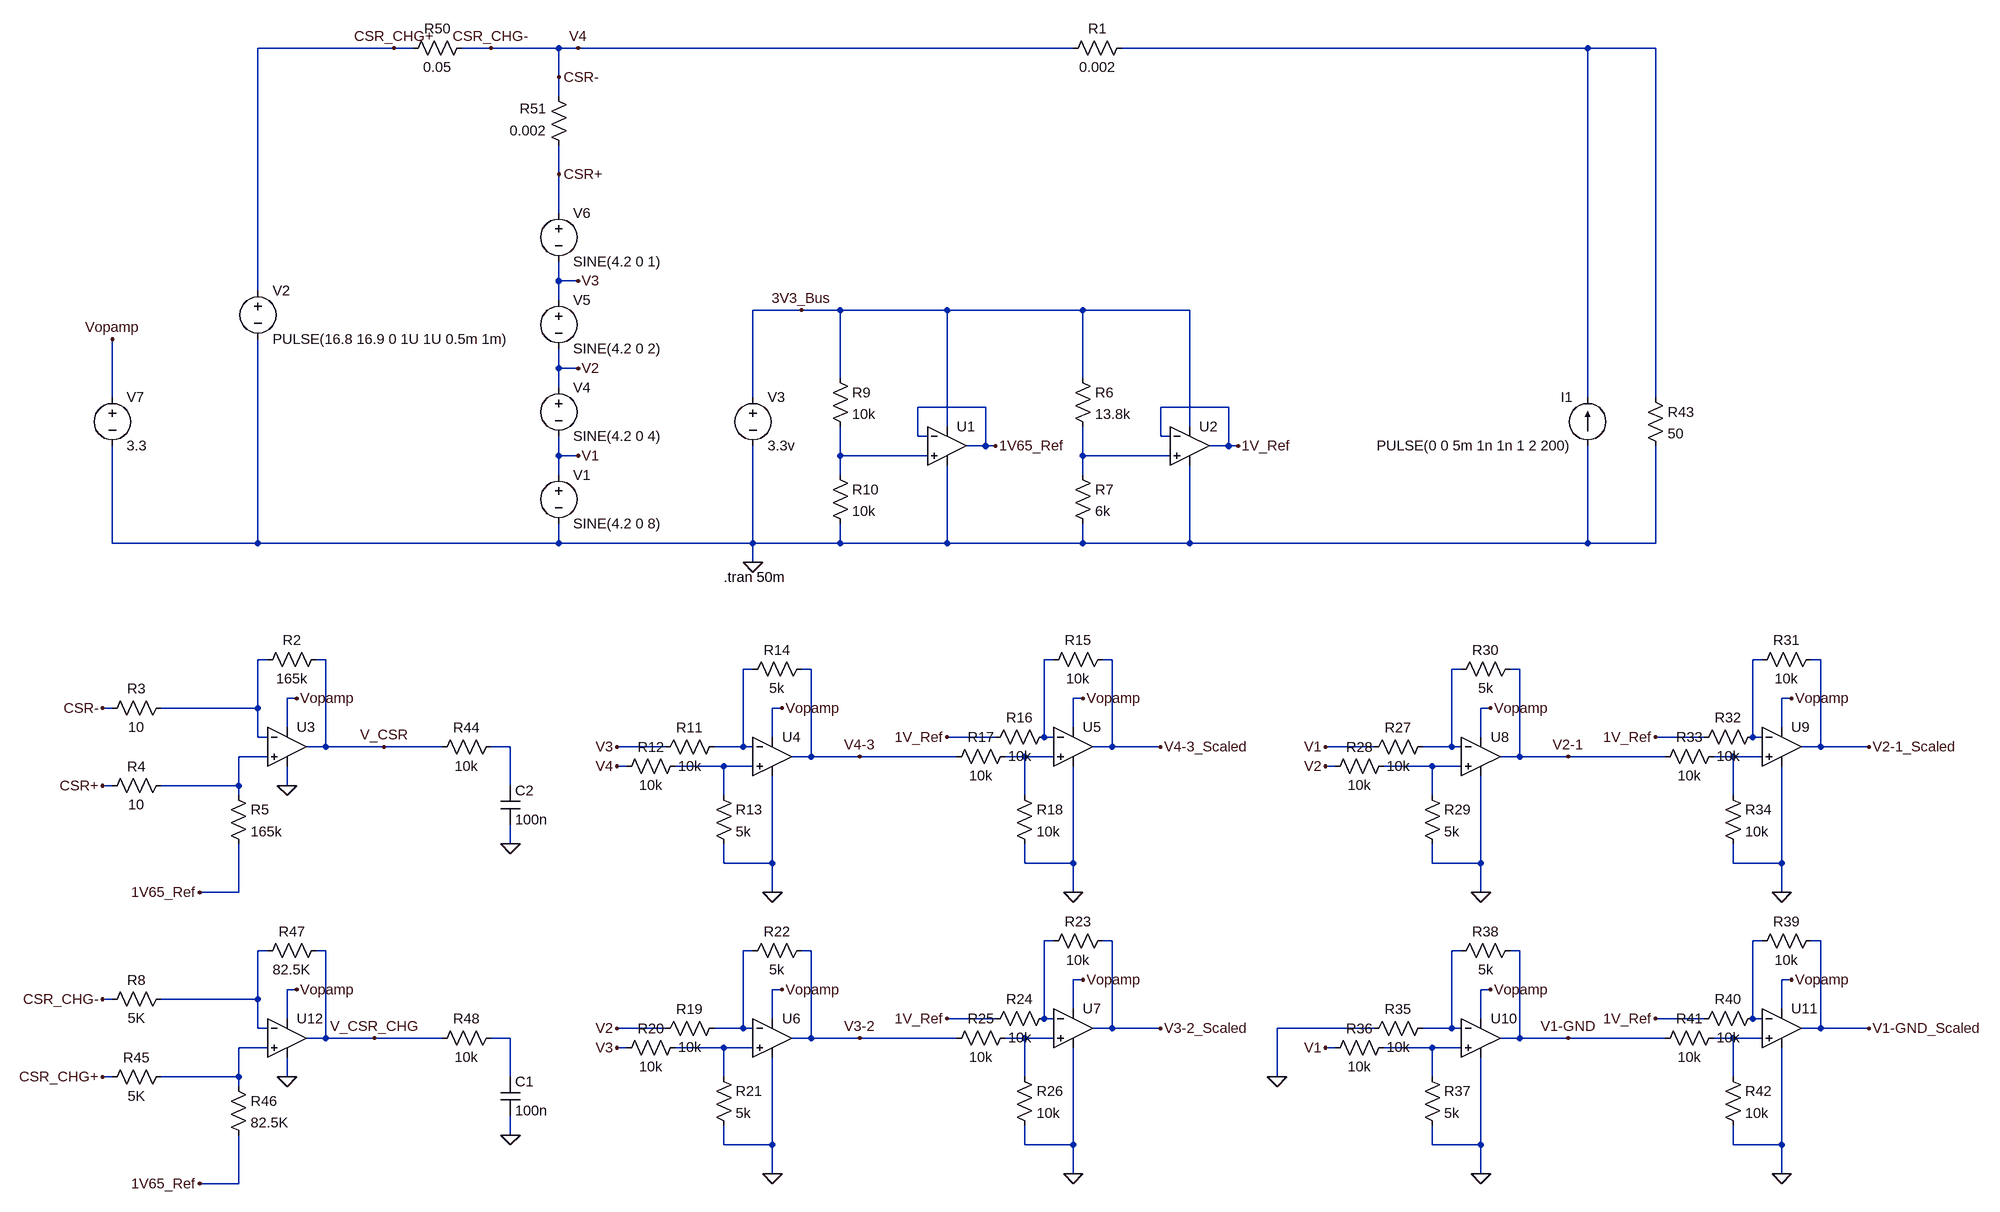
[diagram p0: schematic Op_Amp_Simulation.asc]
Op_Amp_Simulation.asc, the LTspice schematic file:
Version 4
SHEET 1 2680 1404
WIRE 48 -528 -176 -528
WIRE 80 -528 48 -528
WIRE 208 -528 160 -528
WIRE 320 -528 208 -528
WIRE 352 -528 320 -528
WIRE 1168 -528 352 -528
WIRE 2016 -528 1248 -528
WIRE 2128 -528 2016 -528
WIRE 320 -480 320 -528
WIRE 320 -448 320 -480
WIRE 320 -320 320 -368
WIRE 320 -256 320 -320
WIRE 320 -144 320 -176
WIRE 352 -144 320 -144
WIRE -176 -128 -176 -528
WIRE 320 -112 320 -144
WIRE 720 -96 640 -96
WIRE 784 -96 720 -96
WIRE 960 -96 784 -96
WIRE 1184 -96 960 -96
WIRE 1360 -96 1184 -96
WIRE 320 0 320 -32
WIRE 352 0 320 0
WIRE 784 16 784 -96
WIRE 1184 16 1184 -96
WIRE 320 32 320 0
WIRE -416 48 -416 -48
WIRE 640 48 640 -96
WIRE 2016 48 2016 -528
WIRE 2128 48 2128 -528
WIRE 1024 64 912 64
WIRE 1424 64 1312 64
WIRE 960 96 960 -96
WIRE 1360 96 1360 -96
WIRE 912 112 912 64
WIRE 928 112 912 112
WIRE 1312 112 1312 64
WIRE 1328 112 1312 112
WIRE 1024 128 1024 64
WIRE 1024 128 992 128
WIRE 1040 128 1024 128
WIRE 1424 128 1424 64
WIRE 1424 128 1392 128
WIRE 1440 128 1424 128
WIRE 320 144 320 112
WIRE 352 144 320 144
WIRE 784 144 784 96
WIRE 928 144 784 144
WIRE 1184 144 1184 96
WIRE 1328 144 1184 144
WIRE 320 176 320 144
WIRE 784 176 784 144
WIRE 1184 176 1184 144
WIRE -416 288 -416 128
WIRE -176 288 -176 -48
WIRE -176 288 -416 288
WIRE 320 288 320 256
WIRE 320 288 -176 288
WIRE 640 288 640 128
WIRE 640 288 320 288
WIRE 784 288 784 256
WIRE 784 288 640 288
WIRE 960 288 960 160
WIRE 960 288 784 288
WIRE 1184 288 1184 256
WIRE 1184 288 960 288
WIRE 1360 288 1360 160
WIRE 1360 288 1184 288
WIRE 2016 288 2016 128
WIRE 2016 288 1360 288
WIRE 2128 288 2128 128
WIRE 2128 288 2016 288
WIRE 640 320 640 288
WIRE -160 480 -176 480
WIRE -64 480 -80 480
WIRE 1136 480 1120 480
WIRE 1232 480 1216 480
WIRE 2304 480 2288 480
WIRE 2400 480 2384 480
WIRE 640 496 624 496
WIRE 736 496 720 496
WIRE 1808 496 1792 496
WIRE 1904 496 1888 496
WIRE -112 544 -128 544
WIRE 1184 544 1168 544
WIRE 2352 544 2336 544
WIRE -416 560 -432 560
WIRE -176 560 -176 480
WIRE -176 560 -336 560
WIRE 688 560 672 560
WIRE 1856 560 1840 560
WIRE -128 592 -128 544
WIRE 1168 592 1168 544
WIRE 2336 592 2336 544
WIRE -176 608 -176 560
WIRE -160 608 -176 608
WIRE 672 608 672 560
WIRE 1040 608 960 608
WIRE 1120 608 1120 480
WIRE 1136 608 1120 608
WIRE 1840 608 1840 560
WIRE 2208 608 2128 608
WIRE 2288 608 2288 480
WIRE 2304 608 2288 608
WIRE -64 624 -64 480
WIRE -64 624 -96 624
WIRE 32 624 -64 624
WIRE 128 624 32 624
WIRE 240 624 208 624
WIRE 496 624 416 624
WIRE 624 624 624 496
WIRE 624 624 576 624
WIRE 640 624 624 624
WIRE 1232 624 1232 480
WIRE 1232 624 1200 624
WIRE 1312 624 1232 624
WIRE 1664 624 1584 624
WIRE 1792 624 1792 496
WIRE 1792 624 1744 624
WIRE 1808 624 1792 624
WIRE 2400 624 2400 480
WIRE 2400 624 2368 624
WIRE 2480 624 2400 624
WIRE -160 640 -208 640
WIRE 736 640 736 496
WIRE 736 640 704 640
WIRE 816 640 736 640
WIRE 976 640 816 640
WIRE 1088 640 1056 640
WIRE 1136 640 1088 640
WIRE 1904 640 1904 496
WIRE 1904 640 1872 640
WIRE 1984 640 1904 640
WIRE 2144 640 1984 640
WIRE 2256 640 2224 640
WIRE 2304 640 2256 640
WIRE 432 656 416 656
WIRE 592 656 512 656
WIRE 640 656 592 656
WIRE 1600 656 1584 656
WIRE 1760 656 1680 656
WIRE 1808 656 1760 656
WIRE -416 688 -432 688
WIRE -208 688 -208 640
WIRE -208 688 -336 688
WIRE -128 688 -128 656
WIRE 240 688 240 624
WIRE -208 704 -208 688
WIRE 592 704 592 656
WIRE 1088 704 1088 640
WIRE 1760 704 1760 656
WIRE 2256 704 2256 640
WIRE 240 784 240 752
WIRE 592 816 592 784
WIRE 672 816 672 672
WIRE 672 816 592 816
WIRE 1088 816 1088 784
WIRE 1168 816 1168 656
WIRE 1168 816 1088 816
WIRE 1760 816 1760 784
WIRE 1840 816 1840 672
WIRE 1840 816 1760 816
WIRE 2256 816 2256 784
WIRE 2336 816 2336 656
WIRE 2336 816 2256 816
WIRE -208 864 -208 784
WIRE -208 864 -272 864
WIRE 672 864 672 816
WIRE 1168 864 1168 816
WIRE 1840 864 1840 816
WIRE 2336 864 2336 816
WIRE 1136 944 1120 944
WIRE 1232 944 1216 944
WIRE 2304 944 2288 944
WIRE 2400 944 2384 944
WIRE -160 960 -176 960
WIRE -64 960 -80 960
WIRE 640 960 624 960
WIRE 736 960 720 960
WIRE 1808 960 1792 960
WIRE 1904 960 1888 960
WIRE 1184 1008 1168 1008
WIRE 2352 1008 2336 1008
WIRE -112 1024 -128 1024
WIRE 688 1024 672 1024
WIRE 1856 1024 1840 1024
WIRE -416 1040 -432 1040
WIRE -176 1040 -176 960
WIRE -176 1040 -336 1040
WIRE 1168 1056 1168 1008
WIRE 2336 1056 2336 1008
WIRE -128 1072 -128 1024
WIRE 672 1072 672 1024
WIRE 1040 1072 960 1072
WIRE 1120 1072 1120 944
WIRE 1136 1072 1120 1072
WIRE 1840 1072 1840 1024
WIRE 2208 1072 2128 1072
WIRE 2288 1072 2288 944
WIRE 2304 1072 2288 1072
WIRE -176 1088 -176 1040
WIRE -160 1088 -176 1088
WIRE 496 1088 416 1088
WIRE 624 1088 624 960
WIRE 624 1088 576 1088
WIRE 640 1088 624 1088
WIRE 1232 1088 1232 944
WIRE 1232 1088 1200 1088
WIRE 1312 1088 1232 1088
WIRE 1664 1088 1504 1088
WIRE 1792 1088 1792 960
WIRE 1792 1088 1744 1088
WIRE 1808 1088 1792 1088
WIRE 2400 1088 2400 944
WIRE 2400 1088 2368 1088
WIRE 2480 1088 2400 1088
WIRE -64 1104 -64 960
WIRE -64 1104 -96 1104
WIRE 16 1104 -64 1104
WIRE 128 1104 16 1104
WIRE 240 1104 208 1104
WIRE 736 1104 736 960
WIRE 736 1104 704 1104
WIRE 816 1104 736 1104
WIRE 976 1104 816 1104
WIRE 1088 1104 1056 1104
WIRE 1136 1104 1088 1104
WIRE 1904 1104 1904 960
WIRE 1904 1104 1872 1104
WIRE 1984 1104 1904 1104
WIRE 2144 1104 1984 1104
WIRE 2256 1104 2224 1104
WIRE 2304 1104 2256 1104
WIRE -160 1120 -208 1120
WIRE 432 1120 416 1120
WIRE 592 1120 512 1120
WIRE 640 1120 592 1120
WIRE 1600 1120 1584 1120
WIRE 1760 1120 1680 1120
WIRE 1808 1120 1760 1120
WIRE -416 1168 -432 1168
WIRE -208 1168 -208 1120
WIRE -208 1168 -336 1168
WIRE -128 1168 -128 1136
WIRE 240 1168 240 1104
WIRE 592 1168 592 1120
WIRE 1088 1168 1088 1104
WIRE 1504 1168 1504 1088
WIRE 1760 1168 1760 1120
WIRE 2256 1168 2256 1104
WIRE -208 1184 -208 1168
WIRE 240 1264 240 1232
WIRE 592 1280 592 1248
WIRE 672 1280 672 1136
WIRE 672 1280 592 1280
WIRE 1088 1280 1088 1248
WIRE 1168 1280 1168 1120
WIRE 1168 1280 1088 1280
WIRE 1760 1280 1760 1248
WIRE 1840 1280 1840 1136
WIRE 1840 1280 1760 1280
WIRE 2256 1280 2256 1248
WIRE 2336 1280 2336 1120
WIRE 2336 1280 2256 1280
WIRE 672 1328 672 1280
WIRE 1168 1328 1168 1280
WIRE 1840 1328 1840 1280
WIRE 2336 1328 2336 1280
WIRE -208 1344 -208 1264
WIRE -208 1344 -272 1344
FLAG -432 688 CSR+
FLAG -432 560 CSR-
FLAG -272 864 1V65_Ref
FLAG -128 688 0
FLAG 32 624 V_CSR
FLAG 1040 128 1V65_Ref
FLAG 720 -96 3V3_Bus
FLAG 640 320 0
FLAG 1440 128 1V_Ref
FLAG 352 -144 V3
FLAG 352 0 V2
FLAG 352 144 V1
FLAG 416 656 V4
FLAG 416 624 V3
FLAG 672 864 0
FLAG 816 640 V4-3
FLAG 1168 864 0
FLAG 1312 624 V4-3_Scaled
FLAG 960 608 1V_Ref
FLAG 416 1120 V3
FLAG 416 1088 V2
FLAG 672 1328 0
FLAG 816 1104 V3-2
FLAG 1168 1328 0
FLAG 1312 1088 V3-2_Scaled
FLAG 960 1072 1V_Ref
FLAG 1584 656 V2
FLAG 1584 624 V1
FLAG 1840 864 0
FLAG 1984 640 V2-1
FLAG 2336 864 0
FLAG 2480 624 V2-1_Scaled
FLAG 2128 608 1V_Ref
FLAG 1584 1120 V1
FLAG 1840 1328 0
FLAG 1984 1104 V1-GND
FLAG 2336 1328 0
FLAG 2480 1088 V1-GND_Scaled
FLAG 2128 1072 1V_Ref
FLAG 1504 1168 0
FLAG 352 -528 V4
FLAG 240 784 0
FLAG -432 1168 CSR_CHG+
FLAG -432 1040 CSR_CHG-
FLAG -272 1344 1V65_Ref
FLAG -128 1168 0
FLAG 16 1104 V_CSR_CHG
FLAG 240 1264 0
FLAG 48 -528 CSR_CHG+
FLAG 208 -528 CSR_CHG-
FLAG 320 -480 CSR-
FLAG 320 -320 CSR+
FLAG -416 -48 Vopamp
FLAG -112 544 Vopamp
FLAG -112 1024 Vopamp
FLAG 688 1024 Vopamp
FLAG 688 560 Vopamp
FLAG 1184 544 Vopamp
FLAG 1184 1008 Vopamp
FLAG 1856 560 Vopamp
FLAG 1856 1024 Vopamp
FLAG 2352 1008 Vopamp
FLAG 2352 544 Vopamp
SYMBOL res 1152 -512 R270
WINDOW 0 32 56 VTop 2
WINDOW 3 0 56 VBottom 2
SYMATTR InstName R1
SYMATTR Value 0.002
SYMBOL res -320 544 R90
WINDOW 0 0 56 VBottom 2
WINDOW 3 32 56 VTop 2
SYMATTR InstName R3
SYMATTR Value 10
SYMBOL res -320 672 R90
WINDOW 0 0 56 VBottom 2
WINDOW 3 32 56 VTop 2
SYMATTR InstName R4
SYMATTR Value 10
SYMBOL res -224 688 R0
SYMATTR InstName R5
SYMATTR Value 165k
SYMBOL res 768 0 R0
SYMATTR InstName R9
SYMATTR Value 10k
SYMBOL res 768 160 R0
SYMATTR InstName R10
SYMATTR Value 10k
SYMBOL voltage 640 32 R0
WINDOW 123 0 0 Left 0
WINDOW 39 0 0 Left 0
SYMATTR InstName V3
SYMATTR Value 3.3v
SYMBOL res -64 464 R90
WINDOW 0 0 56 VBottom 2
WINDOW 3 32 56 VTop 2
SYMATTR InstName R2
SYMATTR Value 165k
SYMBOL OpAmps\\UniversalOpamp2 960 128 R0
SYMATTR InstName U1
SYMBOL res 1168 0 R0
SYMATTR InstName R6
SYMATTR Value 13.8k
SYMBOL res 1168 160 R0
SYMATTR InstName R7
SYMATTR Value 6k
SYMBOL OpAmps\\UniversalOpamp2 1360 128 R0
SYMATTR InstName U2
SYMBOL voltage 320 160 R0
WINDOW 123 0 0 Left 0
WINDOW 39 0 0 Left 0
SYMATTR InstName V1
SYMATTR Value SINE(4.2 0 8)
SYMBOL voltage 320 16 R0
WINDOW 123 0 0 Left 0
WINDOW 39 0 0 Left 0
SYMATTR InstName V4
SYMATTR Value SINE(4.2 0 4)
SYMBOL voltage 320 -128 R0
WINDOW 123 0 0 Left 0
WINDOW 39 0 0 Left 0
SYMATTR InstName V5
SYMATTR Value SINE(4.2 0 2)
SYMBOL voltage 320 -272 R0
WINDOW 123 0 0 Left 0
WINDOW 39 0 0 Left 0
SYMATTR InstName V6
SYMATTR Value SINE(4.2 0 1)
SYMBOL res 592 608 R90
WINDOW 0 0 56 VBottom 2
WINDOW 3 32 56 VTop 2
SYMATTR InstName R11
SYMATTR Value 10k
SYMBOL res 528 640 R90
WINDOW 0 0 56 VBottom 2
WINDOW 3 32 56 VTop 2
SYMATTR InstName R12
SYMATTR Value 10k
SYMBOL res 576 688 R0
SYMATTR InstName R13
SYMATTR Value 5k
SYMBOL OpAmps\\UniversalOpamp2 672 640 R0
SYMATTR InstName U4
SYMBOL res 736 480 R90
WINDOW 0 0 56 VBottom 2
WINDOW 3 32 56 VTop 2
SYMATTR InstName R14
SYMATTR Value 5k
SYMBOL OpAmps\\UniversalOpamp2 1168 624 R0
SYMATTR InstName U5
SYMBOL res 1232 464 R90
WINDOW 0 0 56 VBottom 2
WINDOW 3 32 56 VTop 2
SYMATTR InstName R15
SYMATTR Value 10k
SYMBOL res 1136 592 R90
WINDOW 0 0 56 VBottom 2
WINDOW 3 32 56 VTop 2
SYMATTR InstName R16
SYMATTR Value 10k
SYMBOL res 1072 624 R90
WINDOW 0 0 56 VBottom 2
WINDOW 3 32 56 VTop 2
SYMATTR InstName R17
SYMATTR Value 10k
SYMBOL res 1072 688 R0
SYMATTR InstName R18
SYMATTR Value 10k
SYMBOL res 592 1072 R90
WINDOW 0 0 56 VBottom 2
WINDOW 3 32 56 VTop 2
SYMATTR InstName R19
SYMATTR Value 10k
SYMBOL res 528 1104 R90
WINDOW 0 0 56 VBottom 2
WINDOW 3 32 56 VTop 2
SYMATTR InstName R20
SYMATTR Value 10k
SYMBOL res 576 1152 R0
SYMATTR InstName R21
SYMATTR Value 5k
SYMBOL OpAmps\\UniversalOpamp2 672 1104 R0
SYMATTR InstName U6
SYMBOL res 736 944 R90
WINDOW 0 0 56 VBottom 2
WINDOW 3 32 56 VTop 2
SYMATTR InstName R22
SYMATTR Value 5k
SYMBOL OpAmps\\UniversalOpamp2 1168 1088 R0
SYMATTR InstName U7
SYMBOL res 1232 928 R90
WINDOW 0 0 56 VBottom 2
WINDOW 3 32 56 VTop 2
SYMATTR InstName R23
SYMATTR Value 10k
SYMBOL res 1136 1056 R90
WINDOW 0 0 56 VBottom 2
WINDOW 3 32 56 VTop 2
SYMATTR InstName R24
SYMATTR Value 10k
SYMBOL res 1072 1088 R90
WINDOW 0 0 56 VBottom 2
WINDOW 3 32 56 VTop 2
SYMATTR InstName R25
SYMATTR Value 10k
SYMBOL res 1072 1152 R0
SYMATTR InstName R26
SYMATTR Value 10k
SYMBOL res 1760 608 R90
WINDOW 0 0 56 VBottom 2
WINDOW 3 32 56 VTop 2
SYMATTR InstName R27
SYMATTR Value 10k
SYMBOL res 1696 640 R90
WINDOW 0 0 56 VBottom 2
WINDOW 3 32 56 VTop 2
SYMATTR InstName R28
SYMATTR Value 10k
SYMBOL res 1744 688 R0
SYMATTR InstName R29
SYMATTR Value 5k
SYMBOL OpAmps\\UniversalOpamp2 1840 640 R0
SYMATTR InstName U8
SYMBOL res 1904 480 R90
WINDOW 0 0 56 VBottom 2
WINDOW 3 32 56 VTop 2
SYMATTR InstName R30
SYMATTR Value 5k
SYMBOL OpAmps\\UniversalOpamp2 2336 624 R0
SYMATTR InstName U9
SYMBOL res 2400 464 R90
WINDOW 0 0 56 VBottom 2
WINDOW 3 32 56 VTop 2
SYMATTR InstName R31
SYMATTR Value 10k
SYMBOL res 2304 592 R90
WINDOW 0 0 56 VBottom 2
WINDOW 3 32 56 VTop 2
SYMATTR InstName R32
SYMATTR Value 10k
SYMBOL res 2240 624 R90
WINDOW 0 0 56 VBottom 2
WINDOW 3 32 56 VTop 2
SYMATTR InstName R33
SYMATTR Value 10k
SYMBOL res 2240 688 R0
SYMATTR InstName R34
SYMATTR Value 10k
SYMBOL res 1760 1072 R90
WINDOW 0 0 56 VBottom 2
WINDOW 3 32 56 VTop 2
SYMATTR InstName R35
SYMATTR Value 10k
SYMBOL res 1696 1104 R90
WINDOW 0 0 56 VBottom 2
WINDOW 3 32 56 VTop 2
SYMATTR InstName R36
SYMATTR Value 10k
SYMBOL res 1744 1152 R0
SYMATTR InstName R37
SYMATTR Value 5k
SYMBOL OpAmps\\UniversalOpamp2 1840 1104 R0
SYMATTR InstName U10
SYMBOL res 1904 944 R90
WINDOW 0 0 56 VBottom 2
WINDOW 3 32 56 VTop 2
SYMATTR InstName R38
SYMATTR Value 5k
SYMBOL OpAmps\\UniversalOpamp2 2336 1088 R0
SYMATTR InstName U11
SYMBOL res 2400 928 R90
WINDOW 0 0 56 VBottom 2
WINDOW 3 32 56 VTop 2
SYMATTR InstName R39
SYMATTR Value 10k
SYMBOL res 2304 1056 R90
WINDOW 0 0 56 VBottom 2
WINDOW 3 32 56 VTop 2
SYMATTR InstName R40
SYMATTR Value 10k
SYMBOL res 2240 1088 R90
WINDOW 0 0 56 VBottom 2
WINDOW 3 32 56 VTop 2
SYMATTR InstName R41
SYMATTR Value 10k
SYMBOL res 2240 1152 R0
SYMATTR InstName R42
SYMATTR Value 10k
SYMBOL res 2112 32 R0
SYMATTR InstName R43
SYMATTR Value 50
SYMBOL res 224 608 R90
WINDOW 0 0 56 VBottom 2
WINDOW 3 32 56 VTop 2
SYMATTR InstName R44
SYMATTR Value 10k
SYMBOL cap 224 688 R0
SYMATTR InstName C2
SYMATTR Value 100n
SYMBOL current 2016 128 R180
WINDOW 0 24 80 Left 2
WINDOW 3 24 0 Left 2
WINDOW 123 0 0 Left 0
WINDOW 39 0 0 Left 0
SYMATTR InstName I1
SYMATTR Value PULSE(0 0 5m 1n 1n 1 2 200)
SYMBOL res -320 1024 R90
WINDOW 0 0 56 VBottom 2
WINDOW 3 32 56 VTop 2
SYMATTR InstName R8
SYMATTR Value 5K
SYMBOL res -320 1152 R90
WINDOW 0 0 56 VBottom 2
WINDOW 3 32 56 VTop 2
SYMATTR InstName R45
SYMATTR Value 5K
SYMBOL res -224 1168 R0
SYMATTR InstName R46
SYMATTR Value 82.5K
SYMBOL res -64 944 R90
WINDOW 0 0 56 VBottom 2
WINDOW 3 32 56 VTop 2
SYMATTR InstName R47
SYMATTR Value 82.5K
SYMBOL res 224 1088 R90
WINDOW 0 0 56 VBottom 2
WINDOW 3 32 56 VTop 2
SYMATTR InstName R48
SYMATTR Value 10k
SYMBOL cap 224 1168 R0
SYMATTR InstName C1
SYMATTR Value 100n
SYMBOL res 64 -512 R270
WINDOW 0 32 56 VTop 2
WINDOW 3 0 56 VBottom 2
SYMATTR InstName R50
SYMATTR Value 0.05
SYMBOL voltage -176 -144 R0
WINDOW 123 0 0 Left 0
WINDOW 39 0 0 Left 0
SYMATTR InstName V2
SYMATTR Value PULSE(16.8 16.9 0 1U 1U 0.5m 1m)
SYMBOL res 336 -352 R180
WINDOW 0 36 76 Left 2
WINDOW 3 36 40 Left 2
SYMATTR InstName R51
SYMATTR Value 0.002
SYMBOL OpAmps\\UniversalOpamp2 -128 624 R0
SYMATTR InstName U3
SYMBOL OpAmps\\UniversalOpamp2 -128 1104 R0
SYMATTR InstName U12
SYMBOL voltage -416 32 R0
WINDOW 123 0 0 Left 0
WINDOW 39 0 0 Left 0
SYMATTR InstName V7
SYMATTR Value 3.3
TEXT 592 344 Left 2 !.tran 50m

The netlist it stands for:
* Op_Amp_Simulation.asc
R1 CSR_CHG- N001 0.002
R3 N004 CSR_CHG- 10
R4 N010 CSR+ 10
R5 N010 1V65_Ref 165k
R9 3V3_Bus N002 10k
R10 N002 0 10k
V3 3V3_Bus 0 3.3v
R2 V_CSR N004 165k
XU1 N002 1V65_Ref 3V3_Bus 0 1V65_Ref level.2 Avol=1Meg GBW=10Meg Slew=10Meg ilimit=25m rail=0 Vos=0 phimargin=45 en=0 enk=0 in=0 ink=0 Rin=500Meg  ; pins IN+ IN- V+ V- OUT
R6 3V3_Bus N003 13.8k
R7 N003 0 6k
XU2 N003 1V_Ref 3V3_Bus 0 1V_Ref level.2 Avol=1Meg GBW=10Meg Slew=10Meg ilimit=25m rail=0 Vos=0 phimargin=45 en=0 enk=0 in=0 ink=0 Rin=500Meg  ; pins IN+ IN- V+ V- OUT
V1 V1 0 SINE(4.2 0 8)
V4 V2 V1 SINE(4.2 0 4)
V5 V3 V2 SINE(4.2 0 2)
V6 CSR+ V3 SINE(4.2 0 1)
R11 N007 V3 10k
R12 N013 CSR_CHG- 10k
R13 N013 0 5k
XU4 N013 N007 Vopamp 0 V4-3 level.2 Avol=1Meg GBW=10Meg Slew=10Meg ilimit=25m rail=0 Vos=0 phimargin=45 en=0 enk=0 in=0 ink=0 Rin=500Meg  ; pins IN+ IN- V+ V- OUT
R14 V4-3 N007 5k
XU5 N011 N005 Vopamp 0 V4-3_Scaled level.2 Avol=1Meg GBW=10Meg Slew=10Meg ilimit=25m rail=0 Vos=0 phimargin=45 en=0 enk=0 in=0 ink=0 Rin=500Meg  ; pins IN+ IN- V+ V- OUT
R15 V4-3_Scaled N005 10k
R16 N005 1V_Ref 10k
R17 N011 V4-3 10k
R18 N011 0 10k
R19 N018 V2 10k
R20 N024 V3 10k
R21 N024 0 5k
XU6 N024 N018 Vopamp 0 V3-2 level.2 Avol=1Meg GBW=10Meg Slew=10Meg ilimit=25m rail=0 Vos=0 phimargin=45 en=0 enk=0 in=0 ink=0 Rin=500Meg  ; pins IN+ IN- V+ V- OUT
R22 V3-2 N018 5k
XU7 N021 N015 Vopamp 0 V3-2_Scaled level.2 Avol=1Meg GBW=10Meg Slew=10Meg ilimit=25m rail=0 Vos=0 phimargin=45 en=0 enk=0 in=0 ink=0 Rin=500Meg  ; pins IN+ IN- V+ V- OUT
R23 V3-2_Scaled N015 10k
R24 N015 1V_Ref 10k
R25 N021 V3-2 10k
R26 N021 0 10k
R27 N008 V1 10k
R28 N014 V2 10k
R29 N014 0 5k
XU8 N014 N008 Vopamp 0 V2-1 level.2 Avol=1Meg GBW=10Meg Slew=10Meg ilimit=25m rail=0 Vos=0 phimargin=45 en=0 enk=0 in=0 ink=0 Rin=500Meg  ; pins IN+ IN- V+ V- OUT
R30 V2-1 N008 5k
XU9 N012 N006 Vopamp 0 V2-1_Scaled level.2 Avol=1Meg GBW=10Meg Slew=10Meg ilimit=25m rail=0 Vos=0 phimargin=45 en=0 enk=0 in=0 ink=0 Rin=500Meg  ; pins IN+ IN- V+ V- OUT
R31 V2-1_Scaled N006 10k
R32 N006 1V_Ref 10k
R33 N012 V2-1 10k
R34 N012 0 10k
R35 N019 0 10k
R36 N025 V1 10k
R37 N025 0 5k
XU10 N025 N019 Vopamp 0 V1-GND level.2 Avol=1Meg GBW=10Meg Slew=10Meg ilimit=25m rail=0 Vos=0 phimargin=45 en=0 enk=0 in=0 ink=0 Rin=500Meg  ; pins IN+ IN- V+ V- OUT
R38 V1-GND N019 5k
XU11 N022 N016 Vopamp 0 V1-GND_Scaled level.2 Avol=1Meg GBW=10Meg Slew=10Meg ilimit=25m rail=0 Vos=0 phimargin=45 en=0 enk=0 in=0 ink=0 Rin=500Meg  ; pins IN+ IN- V+ V- OUT
R39 V1-GND_Scaled N016 10k
R40 N016 1V_Ref 10k
R41 N022 V1-GND 10k
R42 N022 0 10k
R43 N001 0 50
R44 N009 V_CSR 10k
C2 N009 0 100n
I1 0 N001 PULSE(0 0 5m 1n 1n 1 2 200)
R8 N017 CSR_CHG- 5K
R45 N023 CSR_CHG+ 5K
R46 N023 1V65_Ref 82.5K
R47 V_CSR_CHG N017 82.5K
R48 N020 V_CSR_CHG 10k
C1 N020 0 100n
R50 CSR_CHG+ CSR_CHG- 0.05
V2 CSR_CHG+ 0 PULSE(16.8 16.9 0 1U 1U 0.5m 1m)
R51 CSR+ CSR_CHG- 0.002
XU3 N010 N004 Vopamp 0 V_CSR level.2 Avol=1Meg GBW=10Meg Slew=10Meg ilimit=25m rail=0 Vos=0 phimargin=45 en=0 enk=0 in=0 ink=0 Rin=500Meg  ; pins IN+ IN- V+ V- OUT
XU12 N023 N017 Vopamp 0 V_CSR_CHG level.2 Avol=1Meg GBW=10Meg Slew=10Meg ilimit=25m rail=0 Vos=0 phimargin=45 en=0 enk=0 in=0 ink=0 Rin=500Meg  ; pins IN+ IN- V+ V- OUT
V7 Vopamp 0 3.3
.tran 50m
.lib UniversalOpamps2.sub
.backanno
.end